# EAGLE schematic Arduino_THC_rotary_v1.0 (EAGLE 7.1.0)
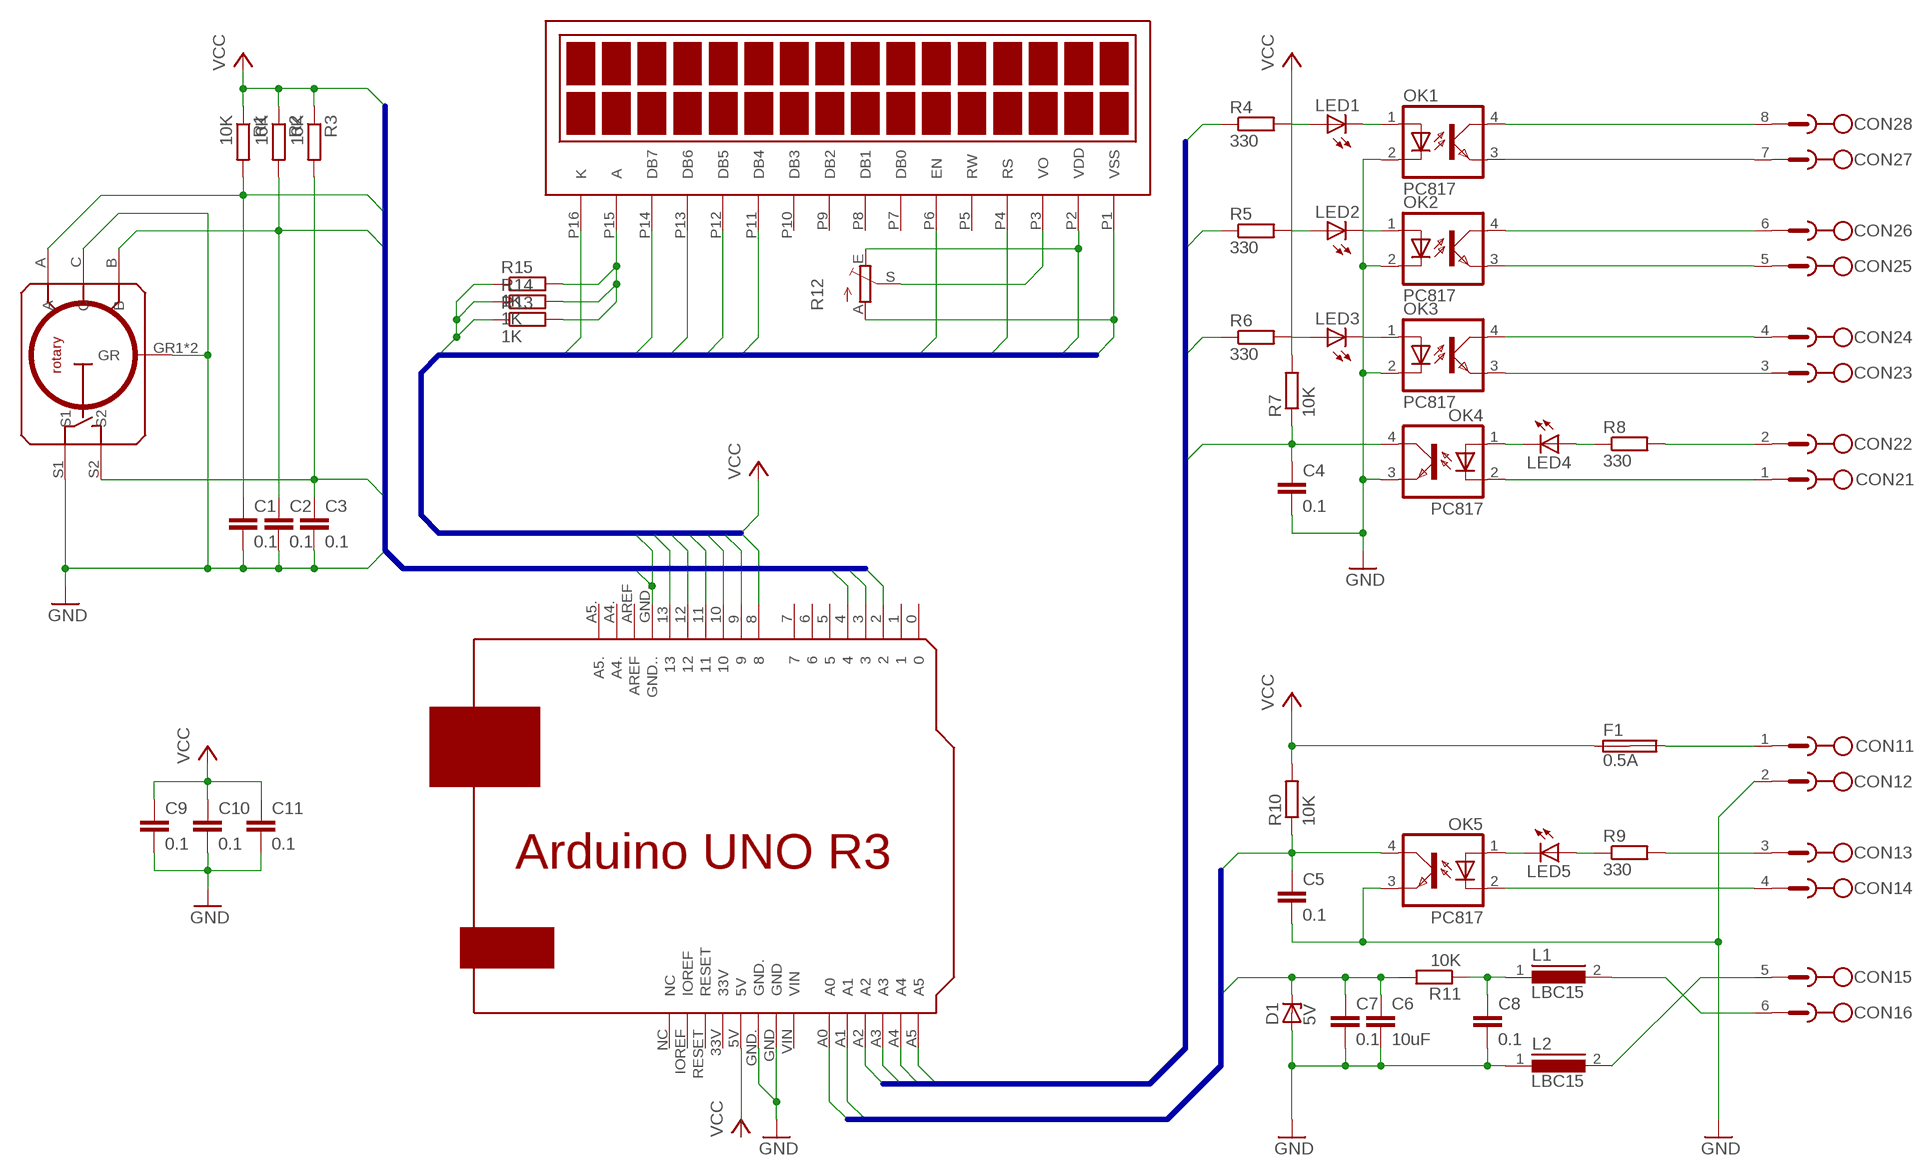
[diagram p0: schematic, sheet 1]

## Parts
C1  0.1  C5/2.5  [C5B2.5]
C2  0.1  C5/2.5  [C5B2.5]
C3  0.1  C5/2.5  [C5B2.5]
C4  0.1  C5/2.5  [C5B2.5]
C5  0.1  C5/2.5  [C5B2.5]
C6  10uF  C5/2.5  [C5B2.5]
C7  0.1  C5/2.5  [C5B2.5]
C8  0.1  C5/2.5  [C5B2.5]
C9  0.1  C5/2.5  [C5B2.5]
C10  0.1  C5/2.5  [C5B2.5]
C11  0.1  C5/2.5  [C5B2.5]
CON1  CY350-6  [CY350-6]
CON2  CY350-8  [CY350-8]
D1  5V  ZENER-DIODEDO41Z10  [DO41Z10]
F1  0.5A  SHK20L  [SHK20L]
L1  LBC15  [LBC15]
L2  LBC15  [LBC15]
LCD  LCD16X2_HD44780  [LCD16X2_HD44780]
LED1  LED3MM  [LED3MM]
LED2  LED3MM  [LED3MM]
LED3  LED3MM  [LED3MM]
LED4  LED3MM  [LED3MM]
LED5  LED3MM  [LED3MM]
OK1  PC817  [DIL04]
OK2  PC817  [DIL04]
OK3  PC817  [DIL04]
OK4  PC817  [DIL04]
OK5  PC817  [DIL04]
R1  10K  R-EU_0207/12  [0207/12]
R2  10K  R-EU_0207/12  [0207/12]
R3  10K  R-EU_0207/12  [0207/12]
R4  330  R-EU_0207/12  [0207/12]
R5  330  R-EU_0207/12  [0207/12]
R6  330  R-EU_0207/12  [0207/12]
R7  10K  R-EU_0207/12  [0207/12]
R8  330  R-EU_0207/12  [0207/12]
R9  330  R-EU_0207/12  [0207/12]
R10  10K  R-EU_0207/12  [0207/12]
R11  10K  R-EU_0207/12  [0207/12]
R12  TRIM_EU-B25X  [B25X]
R13  1K  R-EU_0207/12  [0207/12]
R14  1K  R-EU_0207/12  [0207/12]
R15  1K  R-EU_0207/12  [0207/12]
RO  ROTARY12_24P_V_SWITCH  [ROTAYRY12_24P_V_SWITCH]
UNOR3  ARDUINO_UNO_R3  [ARDUINO_UNO_R3]

## Nets
DB4: LCD.P11(DB4) UNOR3.11
DB5: LCD.P12(DB5) UNOR3.10
DB6: LCD.P13(DB6) UNOR3.9
DB7: LCD.P14(DB7) UNOR3.8
EN: LCD.P6(EN) UNOR3.12
GND: C1.2 C2.2 C3.2 C4.2 C5.2 C6.2 C7.2 C8.2 C9.2 C10.2 C11.2 CON1.2 D1.A L2.1 LCD.P1(VSS) LCD.P16(K) OK1.2(C) OK2.2(C) OK3.2(C) OK4.3(EMIT) OK5.3(EMIT) R12.A RO.C RO.GR1(GR) RO.GR2(GR) RO.S1 UNOR3.GND UNOR3.GND. UNOR3.GND..
I2: C1.1 R1.2 RO.A UNOR3.2
I3: C2.1 R2.2 RO.B UNOR3.3
I4: C3.1 R3.2 RO.S2 UNOR3.4
IA0: C6.1 C7.1 D1.C R11.2 UNOR3.A0
IA1: C5.1 OK5.4(COL) R10.1 UNOR3.A1
IA2: C4.1 OK4.4(COL) R7.1 UNOR3.A2
N$1: LED4.A R8.1
N$2: LED1.A R4.2
N$3: LED1.K(C) OK1.1(A)
N$4: CON1.6 L1.2
N$5: LED2.A R5.2
N$6: LCD.P15(A) R13.2 R14.2 R15.2
N$7: LED2.K(C) OK2.1(A)
N$8: LED3.A R6.2
N$9: LED3.K(C) OK3.1(A)
N$10: CON1.5 L2.2
N$11: CON1.1 F1.2A
N$12: CON1.3 R9.2
N$13: CON1.4 OK5.2(C)
N$14: CON2.3 OK3.3(EMIT)
N$15: CON2.2 R8.2
N$16: CON2.1 OK4.2(C)
N$17: LCD.P3(VO) R12.S
N$18: CON2.4 OK3.4(COL)
N$19: LED5.K(C) OK5.1(A)
N$20: LED5.A R9.1
N$21: CON2.5 OK2.3(EMIT)
N$22: CON2.6 OK2.4(COL)
N$23: CON2.7 OK1.3(EMIT)
N$24: LED4.K(C) OK4.1(A)
N$25: CON2.8 OK1.4(COL)
N$26: C8.1 L1.1 R11.1
OA3: R6.1 UNOR3.A3
OA4: R5.1 UNOR3.A4
OA5: R4.1 UNOR3.A5
RS: LCD.P4(RS) UNOR3.13
VCC: C9.1 C10.1 C11.1 F1.1A LCD.P2(VDD) R1.1 R2.1 R3.1 R7.2 R10.2 R12.E R13.1 R14.1 R15.1 UNOR3.5V
Unconnected: F1.1B F1.2B LCD.P5(RW) LCD.P7(DB0) LCD.P8(DB1) LCD.P9(DB2) LCD.P10(DB3) UNOR3.0 UNOR3.1 UNOR3.5 UNOR3.6 UNOR3.7 UNOR3.33V UNOR3.A4. UNOR3.A5. UNOR3.AREF UNOR3.IOREF UNOR3.NC UNOR3.RESET UNOR3.VIN

## Buses
EN,RS,DB[4..7],VCC,GND
OA5,OA4,OA3,IA2
I2,I3,I4,VCC,GND
IA0,IA1

## Library data of the parts
C1-C11 = capacitor-wima:C: CAPACITOR naming: grid - package width
CON1 = Terminal Blocks:CY350-6: CY350-6
CON2 = Terminal Blocks:CY350-8: CY350-8
D1 = diode:ZENER-DIODE: Z-Diode
F1 = fuse:SHK20L: FUSE HOLDER 5 x 20 mm, SH contact, SHH1 Schukat, E1073 Buerklin; OC_FARNELL: unknown; OC_NEWARK: unknown
L1 L2 = inductors:LBC15: INDUCTOR
LCD = lcd:LCD16X2_HD44780
LED1-LED5 = led:LED: LED OSRAM: - CHIPLED LG R971, LG N971, LY N971, LG Q971, LY Q971, LO R971, LY R971 LH N974, LH R974 LS Q976, LO Q976, LY Q976 LO Q996 - Hyper CHIPLED LW Q18S LB Q993, LB Q99A, LB R99A - SideLED LS A670, LO A670, LY A670, LG A670, LP A670 LB A673, LV A673, LT A673, LW A673 LH A674 LY A675 LS A676, LA A676, LO A676, LY A676, LW A676 LS A679, LY A679, LG A679 - Hyper Micro SIDELED® LS Y876, LA Y876, LO Y876, LY Y876 LT Y87S - SmartLED LW L88C, LW L88S LB L89C, LB L89S, LG L890 LS L89K, LO L89K, LY L89K LS L896, LA L896, LO L896, LY L896 - TOPLED LS T670, LO T670, LY T670, LG T670, LP T670 LSG T670, LSP T670, LSY T670, LOP T670, LYG T670 LG T671, LOG T671, LSG T671 LB T673, LV T673, LT T673, LW T673 LH T674 LS T676, LA T676, LO T676, LY T676, LB T676, LH T676, LSB T676, LW T676 LB T67C, LV T67C, LT T67C, LS T67K, LO T67K, LY T67K, LW E67C LS E67B, LA E67B, LO E67B, LY E67B, LB E67C, LV E67C, LT E67C LW T67C LS T679, LY T679, LG T679 LS T770, LO T770, LY T770, LG T770, LP T770 LB T773, LV T773, LT T773, LW T773 LH T774 LS E675, LA E675, LY E675, LS T675 LS T776, LA T776, LO T776, LY T776, LB T776 LHGB T686 LT T68C, LB T68C - Hyper Mini TOPLED® LB M676 - Mini TOPLED Santana® LG M470 LS M47K, LO M47K, LY M47K Source: http://www.osram.convergy.de LUXEON: - LUMILED® LXK2-PW12-R00, LXK2-PW12-S00, LXK2-PW14-U00, LXK2-PW14-V00 LXK2-PM12-R00, LXK2-PM12-S00, LXK2-PM14-U00 LXK2-PE12-Q00, LXK2-PE12-R00, LXK2-PE12-S00, LXK2-PE14-T00, LXK2-PE14-U00 LXK2-PB12-K00, LXK2-PB12-L00, LXK2-PB12-M00, LXK2-PB14-N00, LXK2-PB14-P00, LXK2-PB14-Q00 LXK2-PR12-L00, LXK2-PR12-M00, LXK2-PR14-Q00, LXK2-PR14-R00 LXK2-PD12-Q00, LXK2-PD12-R00, LXK2-PD12-S00 LXK2-PH12-R00, LXK2-PH12-S00 LXK2-PL12-P00, LXK2-PL12-Q00, LXK2-PL12-R00 Source: www.luxeon.com KINGBRIGHT: KA-3528ASYC Source: www.kingbright.com
OK1-OK5 = optocoupler:PC817: SHARP OPTO COUPLER; MPN: PC817X4J000F; OC_FARNELL: 9707727; OC_NEWARK: 97K7059
R1-R11 R13-R15 = resistor:R-EU_: RESISTOR, European symbol
R12 = pot:TRIM_EU-: POTENTIOMETER
RO = rotary:ROTARY12_24P_V_SWITCH
UNOR3 = Arduino:ARDUINO_UNO_R3: Arduino UNO R3

## Net classes
0 default: width 0.61 mm